# EAGLE design analog_disc_2d (EAGLE 4.16)
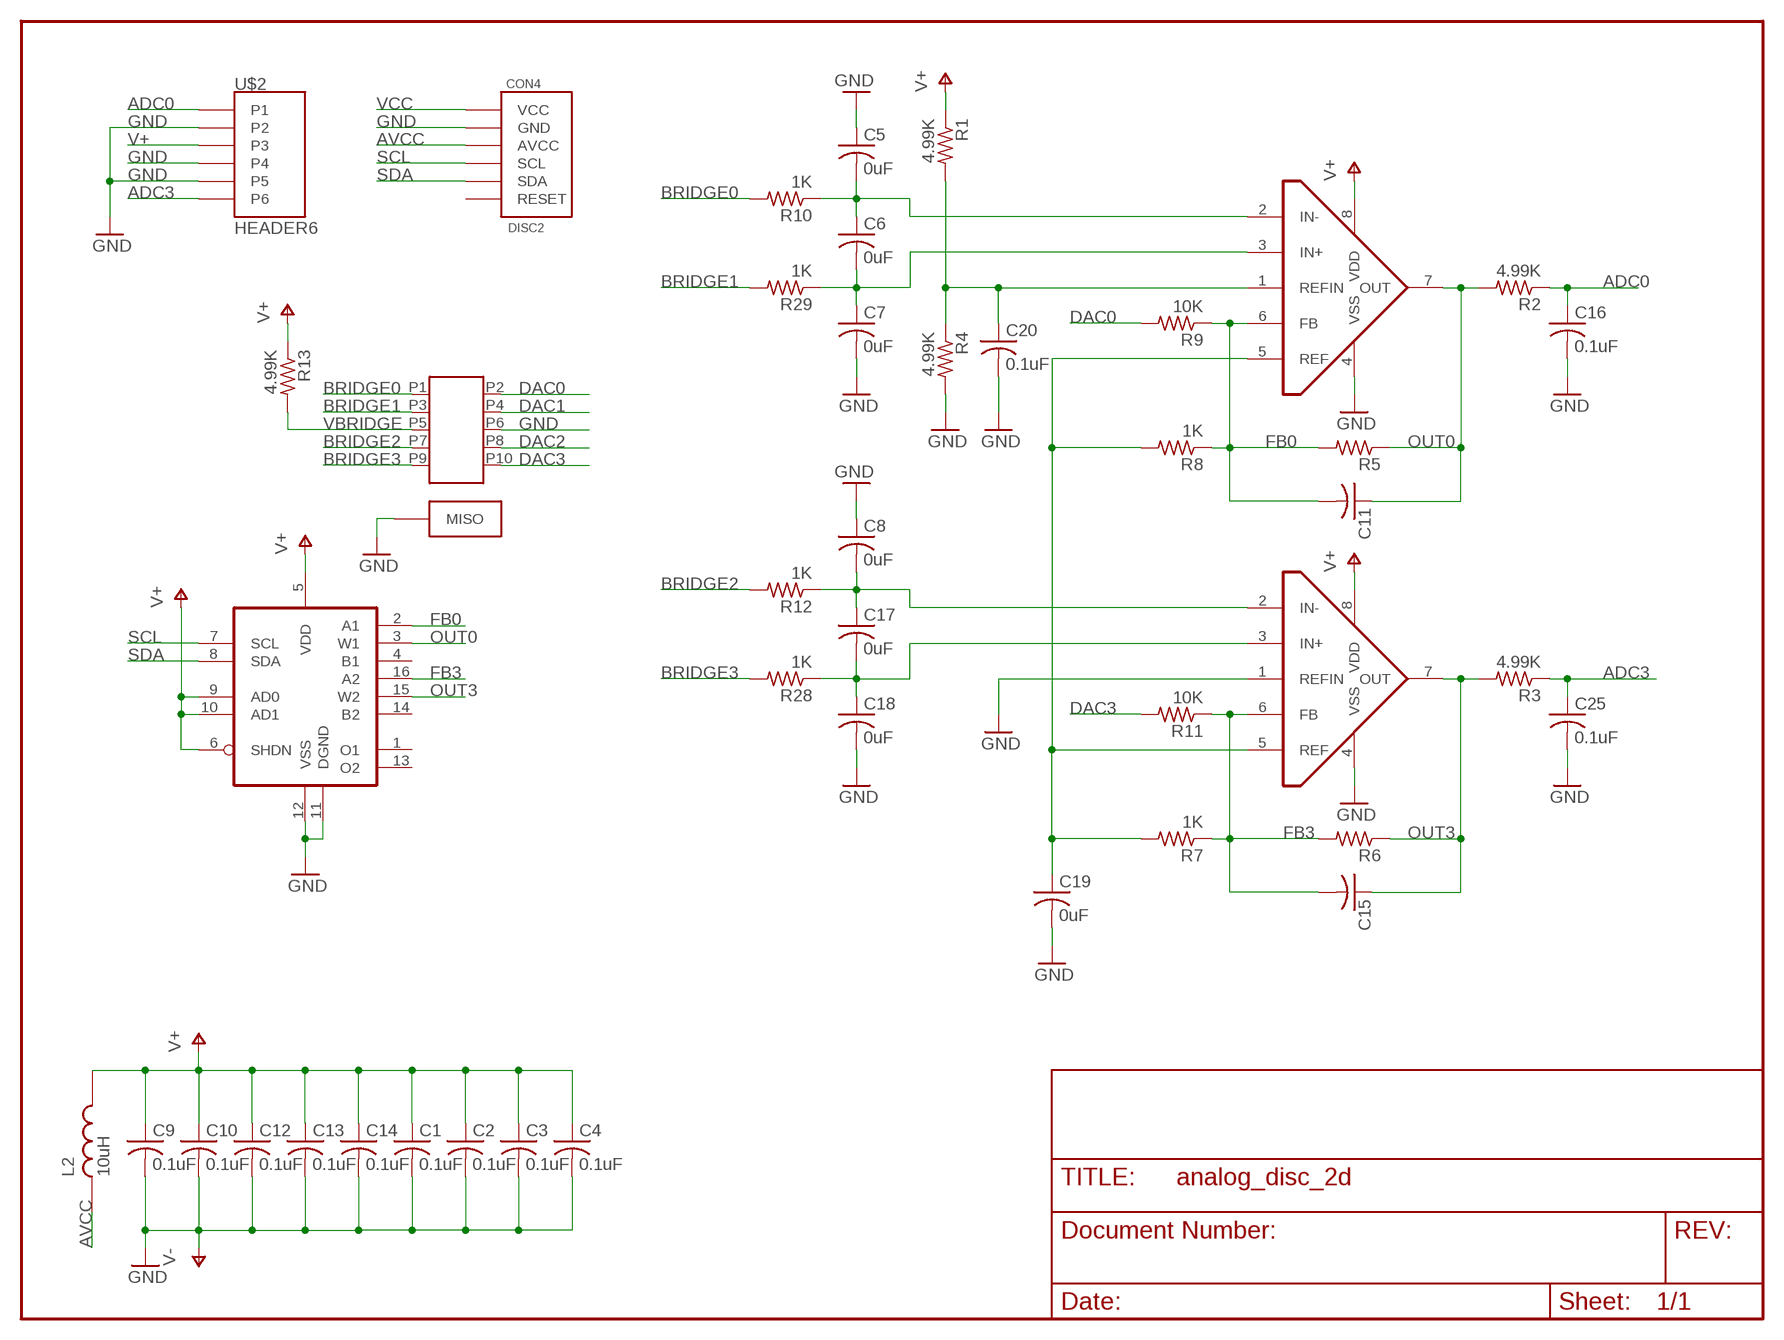
[diagram p0: schematic, sheet 1]

## Parts
C1  0.1uF  C-USC0805  [C0805]
C2  0.1uF  C-USC0805  [C0805]
C3  0.1uF  C-USC0805  [C0805]
C4  0.1uF  C-USC0805  [C0805]
C5  0uF  C-USC0603  [C0603]
C6  0uF  C-USC0603  [C0603]
C7  0uF  C-USC0603  [C0603]
C8  0uF  C-USC0603  [C0603]
C9  0.1uF  C-USC0805  [C0805]
C10  0.1uF  C-USC0805  [C0805]
C11  C-USC0603  [C0603]
C12  0.1uF  C-USC0805  [C0805]
C13  0.1uF  C-USC0805  [C0805]
C14  0.1uF  C-USC0805  [C0805]
C15  C-USC0603  [C0603]
C16  0.1uF  C-USC0603  [C0603]
C17  0uF  C-USC0603  [C0603]
C18  0uF  C-USC0603  [C0603]
C19  0uF  C-USC0603  [C0603]
C20  0.1uF  C-USC0603  [C0603]
C25  0.1uF  C-USC0603  [C0603]
CON4  DISC2  [DISC2]
L2  10uH  IND0805  [M0805]
R1  4.99K  R-US_R0603  [R0603]
R2  4.99K  R-US_R0603  [R0603]
R3  4.99K  R-US_R0603  [R0603]
R4  4.99K  R-US_R0603  [R0603]
R5  R-US_R0603  [R0603]
R6  R-US_R0603  [R0603]
R7  1K  R-US_R0603  [R0603]
R8  1K  R-US_R0603  [R0603]
R9  10K  R-US_R0603  [R0603]
R10  1K  R-US_R0603  [R0603]
R11  10K  R-US_R0603  [R0603]
R12  1K  R-US_R0603  [R0603]
R13  4.99K  R-US_R0603  [R0603]
R28  1K  R-US_R0603  [R0603]
R29  1K  R-US_R0603  [R0603]
U1  MAX4208  [MSOP8]
U2  MAX4208  [MSOP8]
U3  AD5242  [TSSOP16]
U$1  AVR_ISP_MISO  [AVR_ISP_MISO]
U$2  HEADER6  [HEADER6]
U$3  HEADER2X5  [HEADER2X5]

## Nets
ADC0: C16.1 R2.1 U$2.P1
ADC3: C25.1 R3.1 U$2.P6
AVCC: CON4.AVCC L2.1
BRIDGE0: R10.2 U$3.P1
BRIDGE1: R29.2 U$3.P3
BRIDGE2: R12.2 U$3.P7
BRIDGE3: R28.2 U$3.P9
DAC0: R9.2 U$3.P2
DAC1: U$3.P4
DAC2: U$3.P8
DAC3: R11.2 U$3.P10
FB0: C11.2 R5.2 R8.1 R9.1 U1.6(FB) U3.2(A1)
FB3: C15.2 R6.2 R7.1 R11.1 U2.6(FB) U3.16(A2)
GND: C1.2 C2.2 C3.2 C4.2 C5.1 C7.2 C8.1 C9.2 C10.2 C12.2 C13.2 C14.2 C16.2 C18.2 C19.2 C20.2 C25.2 CON4.GND R4.2 U1.4(VSS) U2.1(REFIN) U2.4(VSS) U3.11(DGND) U3.12(VSS) U$1.MISO U$2.P2 U$2.P4 U$2.P5 U$3.P6 ; supply symbol labelled V-
N$1: C6.2 C7.1 R29.1 U1.3(IN+)
N$2: C19.1 R7.2 R8.2 U1.5(REF) U2.5(REF)
N$3: C20.1 R1.2 R4.1 U1.1(REFIN)
N$17: C5.2 C6.1 R10.1 U1.2(IN-)
N$19: C8.2 C17.1 R12.1 U2.2(IN-)
N$27: C17.2 C18.1 R28.1 U2.3(IN+)
OUT0: C11.1 R2.2 R5.1 U1.7(OUT) U3.3(W1)
OUT3: C15.1 R3.2 R6.1 U2.7(OUT) U3.15(W2)
SCL: CON4.SCL U3.7(SCL)
SDA: CON4.SDA U3.8(SDA)
V+: C1.1 C2.1 C3.1 C4.1 C9.1 C10.1 C12.1 C13.1 C14.1 L2.2 R1.1 R13.1 U1.8(VDD) U2.8(VDD) U3.5(VDD) U3.6(SHDN) U3.9(AD0) U3.10(AD1) U$2.P3
VBRIDGE: R13.2 U$3.P5
VCC: CON4.VCC
Unconnected: CON4.RESET U3.1(O1) U3.4(B1) U3.13(O2) U3.14(B2)

## Library data of the parts
C1-C20 C25 = rcl:C-US: CAPACITOR, American symbol
CON4 = anton:DISC2
L2 = anton:IND0805
R1-R13 R28 R29 = rcl:R-US_: RESISTOR, American symbol
U1 U2 = max4208:MAX4208
U3 = anton:AD5242
U$1 = anton:AVR_ISP_MISO
U$2 = anton:HEADER6
U$3 = anton:HEADER2X5

## Board
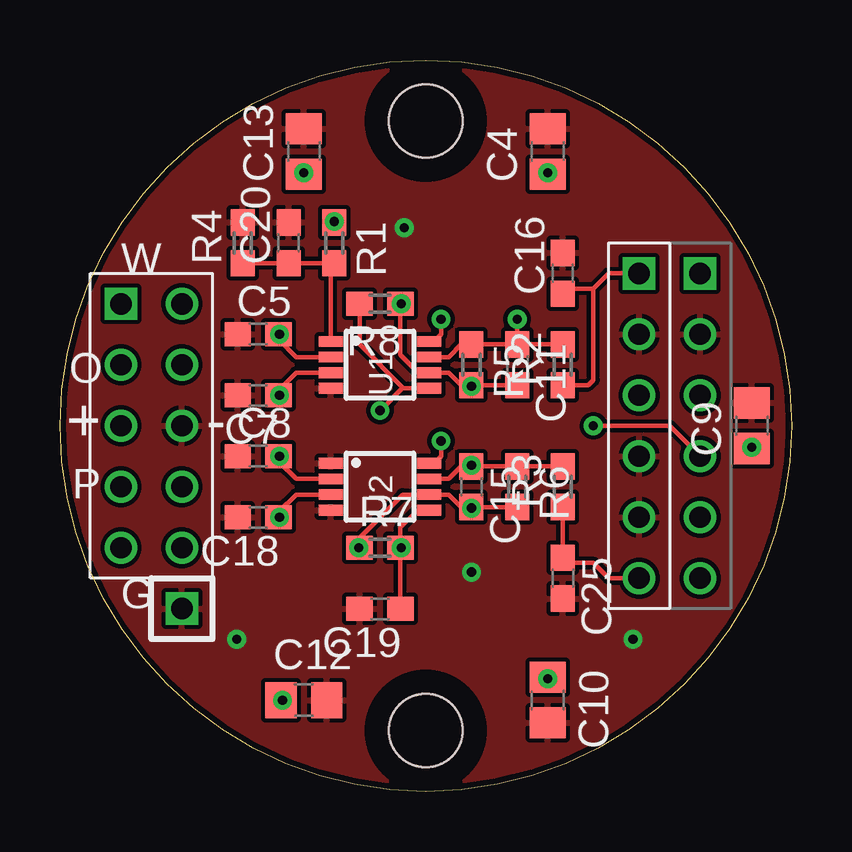
[diagram p1: board, top side]
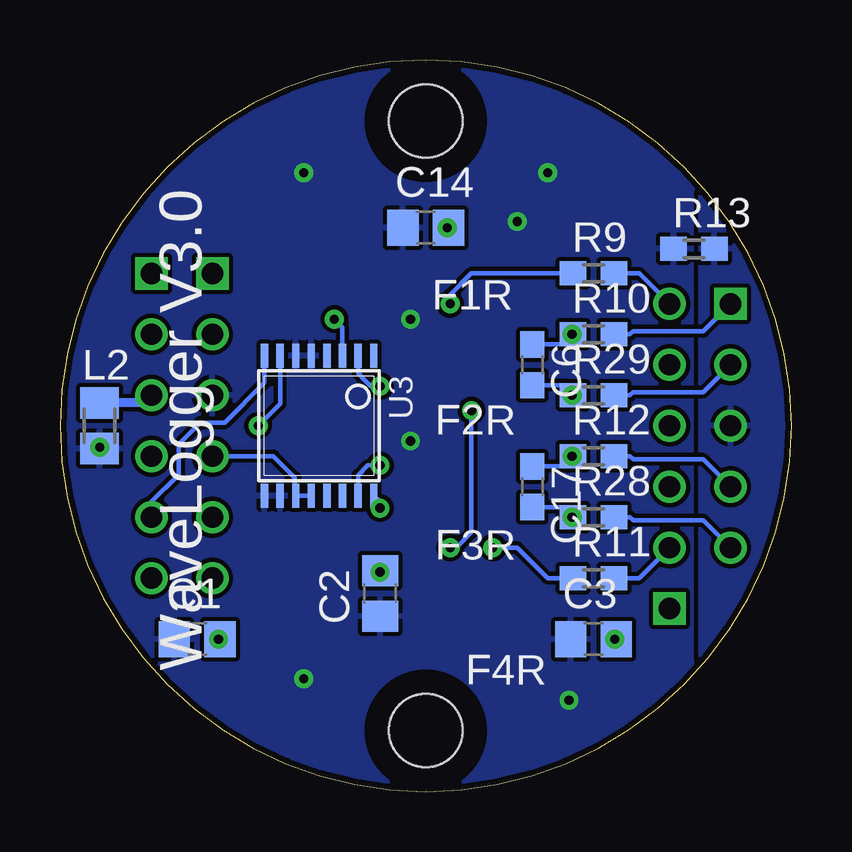
[diagram p2: board, bottom side, seen from below]

Size 30.48 x 30.48 mm. Coordinates in mm from the lower left corner, seen from the top.
Copper layers (1*16): Top 0.035mm / dielectric 1.5mm / Bottom 0.035mm
Design rules "AdvancedCircuts": minimum track width 7mil, minimum drill 15mil, track to track 7mil, track to pad 7mil, pad to pad 7mil, via to via 7mil, smd to smd 0mil, copper to edge 10mil, drill to drill 8mil, minimum pad ring 9mil, minimum via ring 8mil, stop-mask expansion 4mil, vias tented up to drill 0mil, thermal gap 7mil

### Footprints (pad centres in the part's own frame; a part is rotated, then mirrored left to right if it is on the bottom)
C0805 = smd 1.3 x 1.5: 1 -0.95,0; 2 0.95,0
C0603 = smd 1.1 x 1: 1 -0.85,0; 2 0.85,0
DISC2 = drill 0.889 round: AVCC 11.43,1.27; GND 11.43,3.81; RESET 11.43,-6.35; SCL 11.43,-1.27; SDA 11.43,-3.81 | drill 0.889 square: VCC 11.43,6.35 | hole 3.048: 0,-12.7; 0,12.7
M0805 = smd 1.3 x 1.6: 1 -0.95,0; 2 0.95,0
R0603 = smd 1.1 x 1: 1 -0.85,0; 2 0.85,0
MSOP8 = smd 0.45 x 1: 1 -0.975,-2.05; 2 -0.325,-2.05; 3 0.325,-2.05; 4 0.975,-2.05; 5 0.975,2.05; 6 0.325,2.05; 7 -0.325,2.05; 8 -0.975,2.05
TSSOP16 = smd 0.305 x 0.991: 1 -2.275,-2.918; 2 -1.625,-2.918; 3 -0.975,-2.918; 4 -0.325,-2.918; 5 0.325,-2.918; 6 0.975,-2.918; 7 1.625,-2.918; 8 2.275,-2.918; 9 2.275,2.918; 10 1.625,2.918; 11 0.975,2.918; 12 0.325,2.918; 13 -0.325,2.918; 14 -0.975,2.918; 15 -1.625,2.918; 16 -2.275,2.918
AVR_ISP_MISO = drill 0.889 square: MISO 0,0
HEADER6 = drill 0.889 square: P1 0,6.35 | drill 0.889 round: P2 0,3.81; P3 0,1.27; P4 0,-1.27; P5 0,-3.81; P6 0,-6.35
HEADER2X5 = drill 0.889 square: P1 -1.27,5.08 | drill 0.889 round: P2 1.27,5.08; P3 -1.27,2.54; P4 1.27,2.54; P5 -1.27,0; P6 1.27,0; P7 -1.27,-2.54; P8 1.27,-2.54; P9 -1.27,-5.08; P10 1.27,-5.08

### Placement (x,y rotation side)
C1  24.77,6.35 0 bottom
C2  17.15,8.25 90 bottom
C3  8.26,6.35 0 bottom
C4  20.32,26.67 90 top
C5  8.26,19.05 0 top
C6  10.79,17.78 270 bottom
C7  8.26,16.51 180 top
C8  8.26,13.97 0 top
C9  28.83,15.24 90 top
C10  20.32,3.81 270 top
C11  19.05,17.78 270 top
C12  10.16,3.81 0 top
C13  10.16,26.67 90 top
C14  15.24,23.5 0 bottom
C15  17.15,12.7 270 top
C16  20.95,21.59 90 top
C17  10.79,12.7 270 bottom
C18  8.26,11.43 180 top
C19  13.34,7.62 180 top
C20  9.53,22.86 90 top
C25  20.95,8.89 270 top
CON4  15.24,15.24 0 top
L2  28.83,15.24 270 bottom
R1  11.43,22.86 270 top
R2  20.95,17.78 90 top
R3  20.95,12.7 90 top
R4  7.62,22.86 90 top
R5  17.15,17.78 270 top
R6  19.05,12.7 270 top
R7  13.34,10.16 0 top
R8  13.34,20.32 180 top
R9  8.26,21.59 0 bottom
R10  8.26,19.05 0 bottom
R11  8.26,8.89 0 bottom
R12  8.26,13.97 0 bottom
R13  4.06,22.61 0 bottom
R28  8.26,11.43 0 bottom
R29  8.26,16.51 0 bottom
U1  13.34,17.78 270 top
U2  13.34,12.7 270 top
U3  19.69,15.24 180 bottom
U$1  5.08,7.62 0 top
U$2  24.13,15.24 0 top
U$3  3.81,15.24 0 top

### Tracks (layer width: path | path; a pad name or v marks a point on that pad's centre or on a via)
ADC0
  Top 0.178: U$2.P1 22.86,21.59 22.23,20.95 | C16.1 20.95,20.95 22.23,20.95 | R2.1 22.01,16.93 22.23,17.14 22.23,20.95
ADC3
  Top 0.178: R3.1 C25.1 20.95,9.52 22.23,9.52 22.86,8.89 U$2.P6
AVCC
  Bottom 0.381: L2.1 26.99,16.19 CON4.AVCC
  Bottom 0.406: L2.1 28.83,16.13
BRIDGE0
  Bottom 0.178: U$3.P1 3.68,19.18 6.6,19.18 6.73,19.05 R10.2
BRIDGE1
  Bottom 0.178: U$3.P3 3.68,16.64 6.6,16.64 6.73,16.51 R29.2
BRIDGE2
  Bottom 0.178: U$3.P7 3.68,13.84 6.6,13.84 6.73,13.97 R12.2
BRIDGE3
  Bottom 0.178: U$3.P9 3.68,11.3 6.6,11.3 6.73,11.43 R28.2
DAC0
  Bottom 0.178: R9.2 6.35,21.59 U$3.P2
DAC3
  Bottom 0.178: U$3.P10 6.35,8.89 R11.2 7.62,8.89
FB0  (via drill 0.38)
  Top 0.178: R5.2 16.73,16.93 16.2,17.45 U1.6 14.93,17.45 14.19,18.2 R8.1 v14.22,20.32 | C11.2 19.05,16.89 19.01,16.93 R5.2 | R5.2 v17.15,16.89
  Bottom 0.178: R9.1 13.34,21.59 14.22,20.7 v14.22,20.32 | U3.2 18.06,17.43 17.78,17.14 17.53,16.89 v17.15,16.89
FB3  (via drill 0.38)
  Top 0.178: C15.2 16.73,11.85 16.2,12.38 U2.6 14.28,12.38 12.49,10.58 R7.1 v12.45,10.16 | R6.2 19.05,11.81 19.01,11.85 C15.2 | C15.2 v17.15,11.81 C15.2
  Bottom 0.178: R11.1 10.16,8.89 11.43,10.16 v12.45,10.16 | U3.16 17.15,12.07 C15.2 | v17.15,11.81 C15.2 | C15.2 17.15,11.94
GND  (via drill 0.38)
  Bottom 0.178: C3.2 v7.37,6.35 | C2.2 v17.15,9.14 | C14.2 v14.35,23.5 | C1.2 v23.88,6.35 | U3.12 U3.11 20.7,12.32 | 20.7,12.32 | 20.7,12.32 20.7,13.08 21.59,13.97 U$2.P4
  pour Top: 30.48,15.24 arc-90 15.24,0 arc-90 0,15.24 arc-90 15.24,30.48 arc-90
N$1  (via drill 0.38)
  Top 0.178: U1.3 9.84,17.45 9.11,16.73 C7.1 v9.14,16.51
  Bottom 0.178: C6.2 9.31,16.93 8.89,16.51 C7.1 v9.14,16.51
N$2  (via drill 0.38)
  Top 0.178: R7.2 14.19,11.01 14.9,11.73 U2.5 | R8.2 12.49,18.63 14.31,16.8 U1.5 14.27,16.8 v13.34,15.88 | C19.1 13.97,7.62 14.19,7.84 R7.2 | R7.2 13.97,10.16 | R7.2 v14.22,10.16
  Bottom 0.178: v13.34,15.88 13.34,10.79 13.97,10.16 v14.22,10.16
N$3
  Top 0.178: R4.1 9.31,22.01 9.53,22.22 C20.1 11.22,22.01 11.43,22.22 | 11.43,22.22 R1.2 | U1.1 11.29,22.08 11.43,22.22
N$17  (via drill 0.38)
  Top 0.178: U1.2 9.84,18.11 9.11,18.84 R10.1 v9.14,19.05
  Bottom 0.178: C6.1 9.31,18.63 8.89,19.05 R10.1 v9.14,19.05
N$19  (via drill 0.38)
  Top 0.178: C8.2 v9.14,13.97 9.14,13.72 9.84,13.02 U2.2
  Bottom 0.178: v9.14,13.97 C8.2 8.89,13.97 9.31,13.55 C17.1
N$27  (via drill 0.38)
  Top 0.178: C18.1 v9.14,11.43 9.14,11.68 9.84,12.38 U2.3
  Bottom 0.178: v9.14,11.43 C18.1 8.89,11.43 9.31,11.85 C17.2
OUT0  (via drill 0.38)
  Top 0.178: U1.7 16.2,18.11 16.73,18.63 R5.1 19.01,18.63 19.05,18.67 C11.1 | R2.2 20.95,18.41 20.74,18.63 C11.1 | C11.1 19.05,18.41 | C11.1 v19.05,19.68
  Bottom 0.178: U3.3 18.71,19.34 v19.05,19.68
OUT3  (via drill 0.38)
  Top 0.178: U2.7 16.2,13.02 16.73,13.55 C15.1 | C15.1 19.01,13.55 19.05,13.59 R6.1 20.74,13.55 20.95,13.34 R3.2 | C15.1 17.15,13.34 | v17.15,13.59 C15.1
  Bottom 0.178: U3.15 18.06,13.18 17.65,13.59 v17.15,13.59 | U3.15 18.06,12.29 18.03,12.32 18.04,12.32 U3.15
SCL  (via drill 0.38)
  Top 0.178: CON4.SCL 25.4,15.24 v22.23,15.24
  Bottom 0.178: U3.7 21.31,16.16 v22.23,15.24
SDA
  Bottom 0.178: CON4.SDA 26.67,12.07 25.53,13.21 25.53,14.48 24.64,15.37 23.62,15.37 21.96,17.03 U3.8
V+  (via drill 0.38, 0.38 pad 0.64)
  Top 0.178: C9.1 v28.83,14.35 | R1.1 v11.43,23.75 | U1.8 15.58,18.75 15.88,19.05 v15.88,19.68 | U2.8 15.58,13.68 15.88,13.97 v15.88,14.61 | C12.1 v9.27,3.81 | C10.1 v20.32,4.7 | C13.1 v10.16,25.78 | C4.1 v20.32,25.78
  Bottom 0.178: 28.83,14.22 C9.1 v28.83,14.35
  pour Bottom (rank 3): 15.24,30.48 arc-90 30.48,15.24 arc-90 15.24,0 arc-90 0,15.24 arc-90
VBRIDGE
  pour Bottom (rank 2): 0,15.24 0,21.59 3.81,25.4 3.81,5.08 0,8.89

### Text on the board
tNames: W | O | + | - | P | G
bNames: WaveLogger V3.0 | F1R | F2R | F3R | F4R